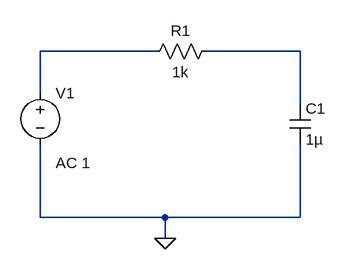
[diagram p0: schematic low-pass-filter.asc]
low-pass-filter.asc, the LTspice schematic file:
Version 4
SHEET 1 880 680
WIRE 256 64 80 64
WIRE 480 64 336 64
WIRE 80 128 80 64
WIRE 480 144 480 64
WIRE 80 320 80 208
WIRE 272 320 80 320
WIRE 480 320 480 208
WIRE 480 320 272 320
WIRE 272 352 272 320
FLAG 272 352 0
SYMBOL voltage 80 112 R0
WINDOW 123 24 124 Left 2
WINDOW 39 0 0 Left 0
SYMATTR InstName V1
SYMATTR Value ""
SYMATTR Value2 AC 1
SYMBOL res 352 48 R90
WINDOW 0 0 56 VBottom 2
WINDOW 3 32 56 VTop 2
SYMATTR InstName R1
SYMATTR Value 1k
SYMBOL cap 464 144 R0
SYMATTR InstName C1
SYMATTR Value 1µ

The netlist it stands for:
* low-pass-filter.asc
V1 N001 0 AC 1
R1 N002 N001 1k
C1 N002 0 1µ
.backanno
.end